# EAGLE design Potentiometer (EAGLE 5.04)
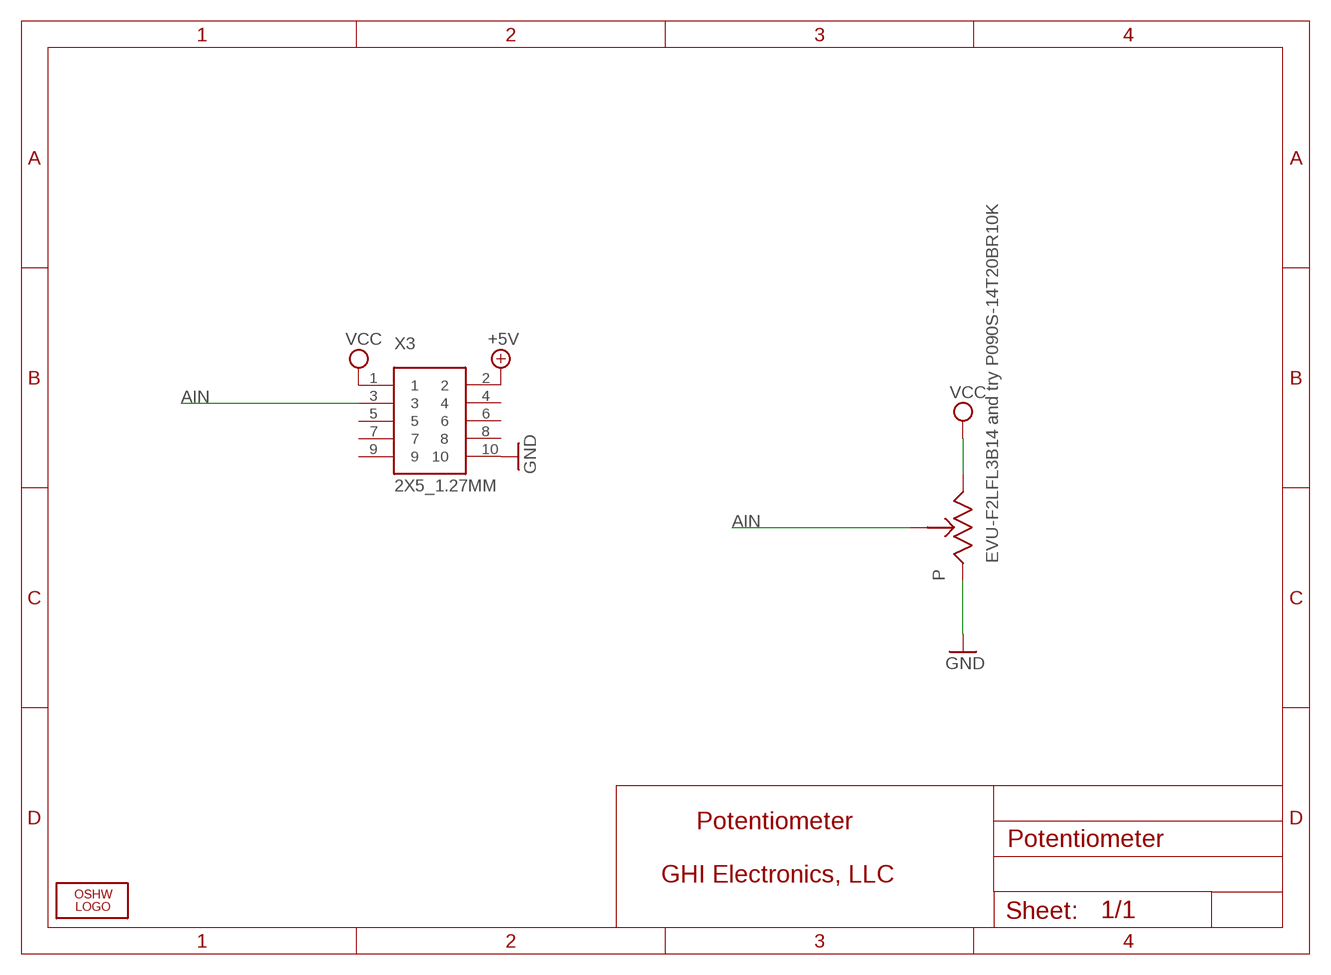
[diagram p0: schematic, sheet 1]

## Parts
LOGO1  LOGO-OSHW-FILLX0200-NT  [OSHW_FILLX200_NOTEXT]
P  EVU-F2LFL3B14 and try P090S-14T20BR10K  EVU-XXXX  [EVU-XXXX]
X3  2X5_1.27MM  [2X5_1.27MM]

## Nets
+5V [power]: X3.2
AIN: P.2(C) X3.3
GND [power]: P.1(L) X3.10
VCC [power]: P.3(R) X3.1
Unconnected: X3.4 X3.5 X3.6 X3.7 X3.8 X3.9

## Notes on the sheet
- Potentiometer
- GHI Electronics, LLC

## Library data of the parts
LOGO1 = Logo:LOGO-OSHW-FILL
P = GHI:EVU-XXXX
X3 = GHI:2X5_1.27MM

## Net classes
0 default: width 0.254 mm, drill 0.381 mm, clearance 0.203 mm

## Board
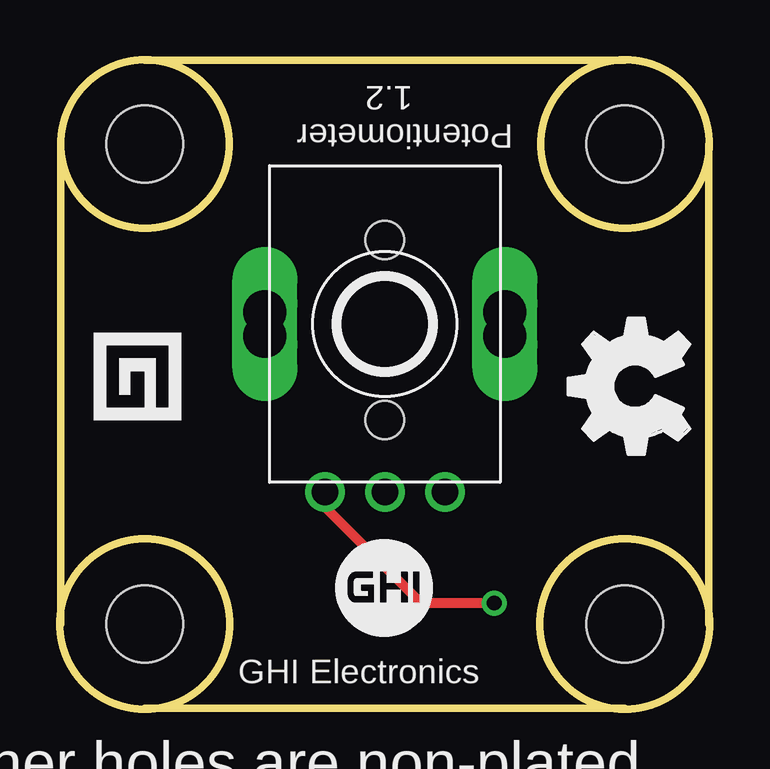
[diagram p1: board, top side]
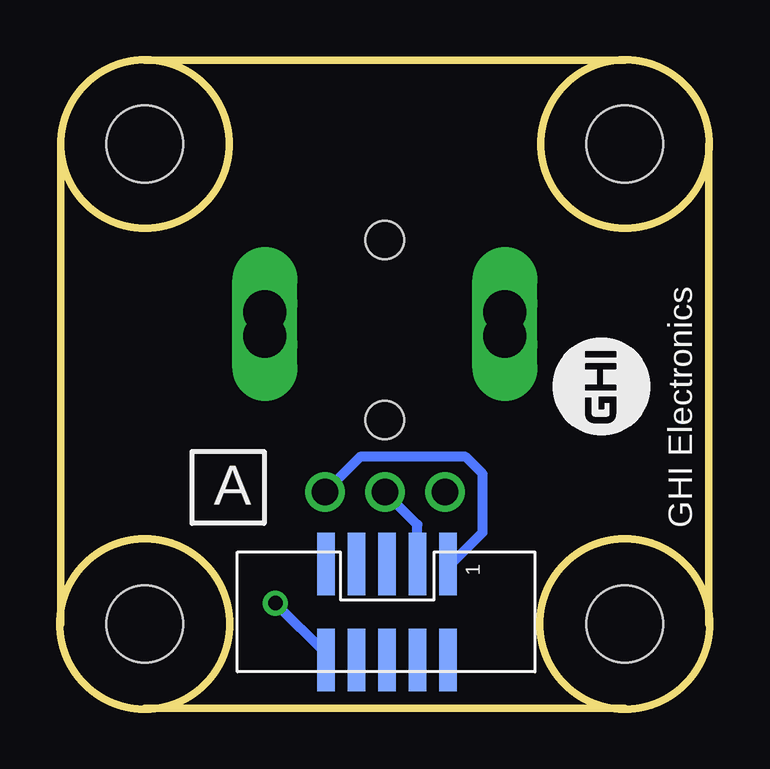
[diagram p2: board, bottom side, seen from below]

Size 27.07 x 27.04 mm. Coordinates in mm from the lower left corner, seen from the top.
Outline: 0.04,3.54 0.04,23.54
Outline: 27.04,23.54 27.04,3.54
Outline: 23.54,27.04 3.54,27.04
Outline: 3.54,0.04 23.54,0.04
Outline: circle at 23.54,23.54 radius 3.5
Outline: circle at 3.54,23.54 radius 3.5
Outline: circle at 3.54,3.54 radius 3.54
Outline: circle at 23.54,3.54 radius 3.54
Copper layers (1+16): Top 0.035mm / dielectric 1.5mm / Bottom 0.035mm
Design rules "default *": minimum track width 8mil, minimum drill 12mil, track to track 8mil, track to pad 8mil, pad to pad 8mil, via to via 8mil, smd to smd 8mil, copper to edge 15mil, drill to drill 8mil, minimum pad ring 10mil, minimum via ring 7mil, stop-mask expansion 4mil, vias tented up to drill 50mil, thermal gap 10mil
Holes 3.2 mm at 23.54,3.54 3.54,23.54 23.54,23.54 3.54,3.54

### Footprints (pad centres in the part's own frame; a part is rotated, then mirrored left to right if it is on the bottom)
EVU-XXXX = drill 1.1 round: 1 -2.5,-7; 2 0,-7; 3 2.5,-7 | drill 1.8 long: P$4 -5,0.5; P$5 -5,-0.5; P$6 5,-0.5; P$7 5,0.5 | hole 1.6: 0,-4; 0,3.5
2X5_1.27MM = smd 2.6 x 0.74: 1 -2,2.58; 2 2,2.58; 3 -2,1.31; 4 2,1.31; 5 -2,0.04; 6 2,0.04; 7 -2,-1.23; 8 2,-1.23; 9 -2,-2.5; 10 2,-2.5

### Placement (x,y rotation side)
LOGO1  26.25,10.6 90 top
P  13.54,16.04 0 top
X3  13.49,4.04 270 bottom

### Tracks (layer width: path | path; a pad name or v marks a point on that pad's centre or on a via)
AIN
  Bottom 0.406: X3.3 12.18,7.68 P.2
GND  (via drill 0.61)
  Top 0.406: v18.09,4.4 15.05,4.4 11.08,8.37 11.08,8.99 P.1
  Bottom 0.406: X3.10 15.99,2.29 v18.09,4.4
VCC
  Bottom 0.406: X3.1 10.77,6.04 9.46,7.35 9.46,9.79 10.17,10.5 14.57,10.5 P.3

### Text on the board
tPlace: 1.2 | Potentiometer | GHI Electronics | Corner holes are non-plated | Black board with white text | do not add manufacturing codes
bPlace: GHI Electronics | A